# Altium schematic sheet Communications.SchDoc
size A4
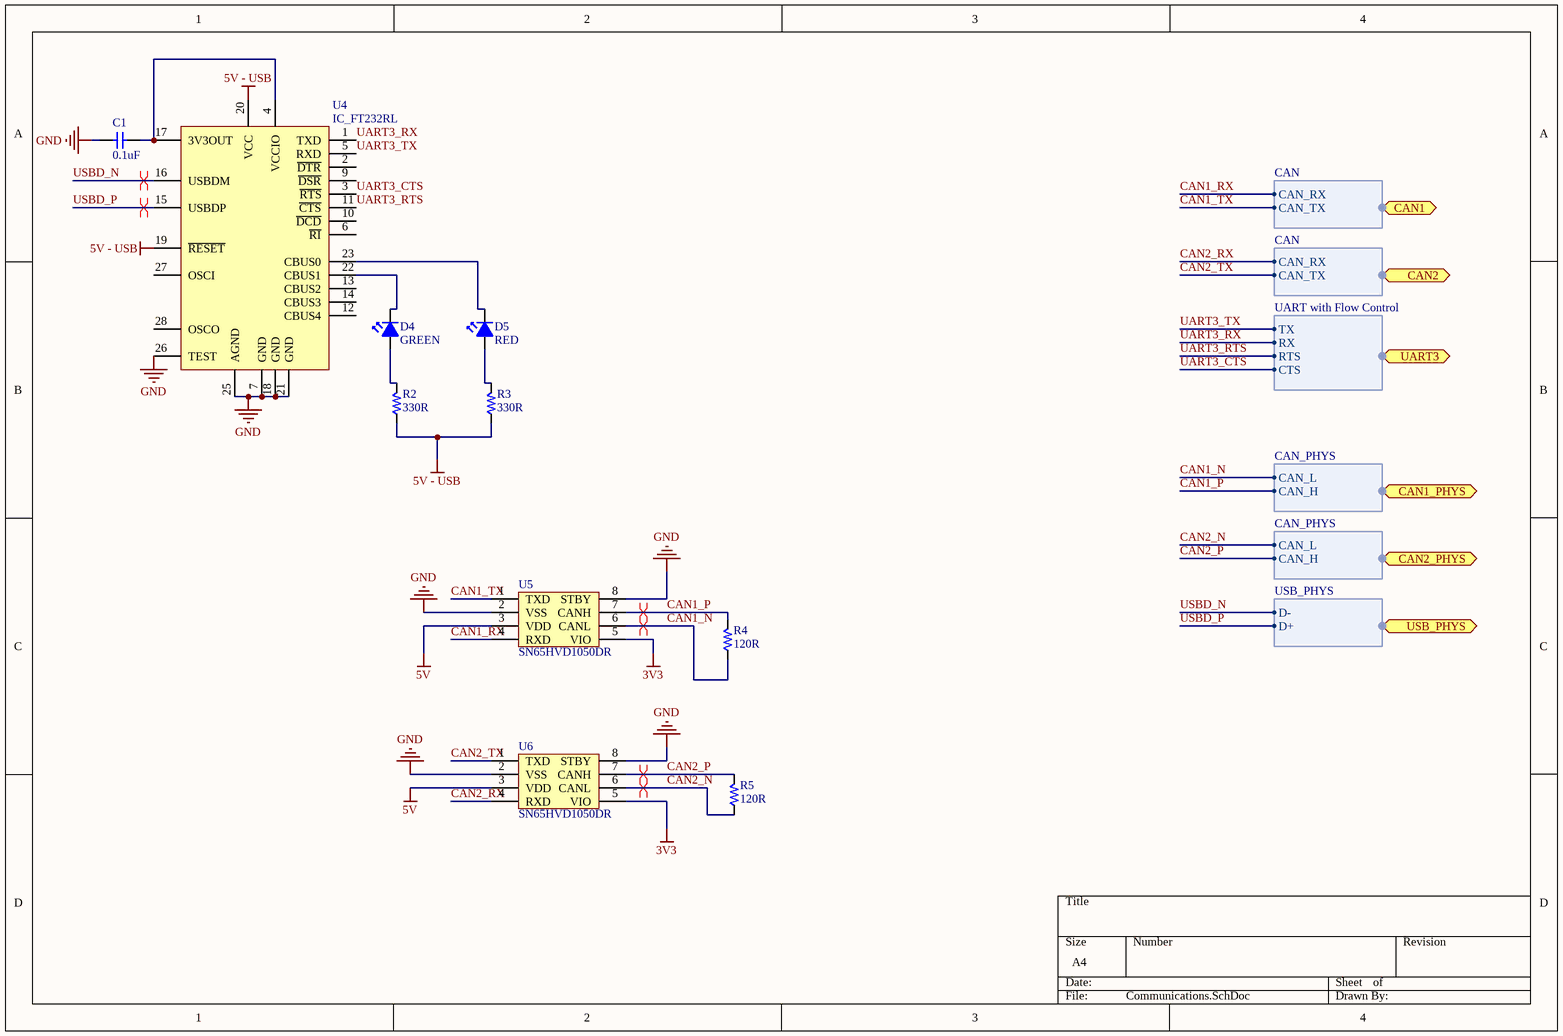
[diagram p0: Communications.SchDoc]

## Parts
C1  value 0.1uF  [PCB_GENERIC_SMD_0603]  (hidden comment: C060-000U1-00)
D4  Color: GREEN  [SMD_0603_LED]  (hidden comment: D060-000G2-00)
D5  Color: RED  [SMD_0603_LED]  (hidden comment: D060-000R2-00)
R2  value 330R  [PCB_GENERIC_SMD_0603]  (hidden comment: R060-00331-05)
R3  value 330R  [PCB_GENERIC_SMD_0603]  (hidden comment: R060-00331-05)
R4  value 120R  [PCB_GENERIC_SMD_0603]  (hidden comment: R060-00121-05)
R5  value 120R  [PCB_GENERIC_SMD_0603]  (hidden comment: R060-00121-05)
U4  IC_FT232RL  [SSOP-28]
U5  SN65HVD1050DR  [SOIC127P600X175-8N]
U6  SN65HVD1050DR  [SOIC127P600X175-8N]

## Ports
CAN1 (harness CAN), CAN1_PHYS (harness CAN_PHYS), CAN2 (harness CAN), CAN2_PHYS (harness CAN_PHYS), UART3 (harness UART with Flow Control), USB_PHYS (harness USB_PHYS)

## Harnesses
CAN_PHYS: CAN_L, CAN_H
CAN: CAN_RX, CAN_TX
UART with Flow Control: TX, RX, RTS, CTS
USB_PHYS: D-, D+

## Nets
3V3: U5.5(VIO) U6.5(VIO)
5V: U5.3(VDD) U6.3(VDD)
5V - USB: R2.1 R3.1 U4.19(~{RESET}) U4.20(VCC)
GND: C1.1 U4.7(GND) U4.18(GND) U4.21(GND) U4.25(AGND) U4.26(TEST) U5.2(VSS) U5.8(STBY) U6.2(VSS) U6.8(STBY)
NC: U4.8(NC) U4.24(NC)
CAN1_N: R4.1 U5.6(CANL) ; port CAN1_PHYS.CAN_L
CAN1_P: R4.2 U5.7(CANH) ; port CAN1_PHYS.CAN_H
CAN1_RX: U5.4(RXD) ; port CAN1.CAN_RX
CAN1_TX: U5.1(TXD) ; port CAN1.CAN_TX
CAN2_N: R5.1 U6.6(CANL) ; port CAN2_PHYS.CAN_L
CAN2_P: R5.2 U6.7(CANH) ; port CAN2_PHYS.CAN_H
CAN2_RX: U6.4(RXD) ; port CAN2.CAN_RX
CAN2_TX: U6.1(TXD) ; port CAN2.CAN_TX
UART3_CTS: U4.3(~{RTS}) ; port UART3.CTS
UART3_RTS: U4.11(~{CTS}) ; port UART3.RTS
UART3_RX: U4.1(TXD) ; port UART3.RX
UART3_TX: U4.5(RXD) ; port UART3.TX
USBD_N: U4.16(USBDM) ; port USB_PHYS.D-
USBD_P: U4.15(USBDP) ; port USB_PHYS.D+
NetC1_2: C1.2 U4.4(VCCIO) U4.17(3V3OUT)
NetD4_1: D4.1(K) U4.22(CBUS1)
NetD4_2: D4.2(A) R2.2
NetD5_1: D5.1(K) U4.23(CBUS0)
NetD5_2: D5.2(A) R3.2

Not connected (* = marked no-connect by the designer): U4 2(~{DTR}) 6(~{RI}) 9(~{DSR}) 10(~{DCD}) 12(CBUS4) 13(CBUS2) 14(CBUS3) 27(OSCI) 28(OSCO)

## Layout directives
differential pair: CAN1_N, CAN1_P, CAN2_N, CAN2_P, USBD_N, USBD_P

## Library data of the parts
C1 = C060-000U1-00: CAP CER 0603 0.1uF 16V X5R 20%; Tolerance: 20%; Voltage: 16V; Package: 0603
D4 = D060-000G2-00: LED 0603 GREEN 3.2Vf 20mA; Supplier 1: Digi-Key; Supplier Part Number 1: 732-4971-1-ND
D5 = D060-000R2-00: LED 0603 RED 2Vf 20mA; Supplier 1: Digi-Key; Supplier Part Number 1: 732-4978-1-ND
R2 R3 = R060-00331-05: RES 0603 330ohm 5% 63mW; Tolerance: 5%; Power: 63mW; Package: 0603
R4 R5 = R060-00121-05: RES 0603 120ohm 5% 63mW; Tolerance: 5%; Power: 63mW; Package: 0603
U4 = IC_FT232RL: FT232R USB UART; Manufacturer: *; Note: *; ManufacturerPartNo: *
U5 U6 = SN65HVD1050DR: IC EMC CAN TRANSCEIVER 8-SOIC; Supplier 1: Digi-Key; Supplier Part Number 1: 296-26335-1-ND